# Altium project mb1191.PrjPCB (part 2 of 3)

## Sheet Arduino_ Connectors.SchDoc: Arduino UNO connectors
size A4; Date: 25-FEB-2015; Author: A.B; CompanyName: STMicroelectronics; Address1: 12, Rue Jules HOROWITZ; Address2: 38019 Grenoble; Address3: FRANCE; DocumentNumber: MB1191; Revision: B-02; SheetNumber: 8; SheetTotal: 14; Project: STM32F746G-DISCO
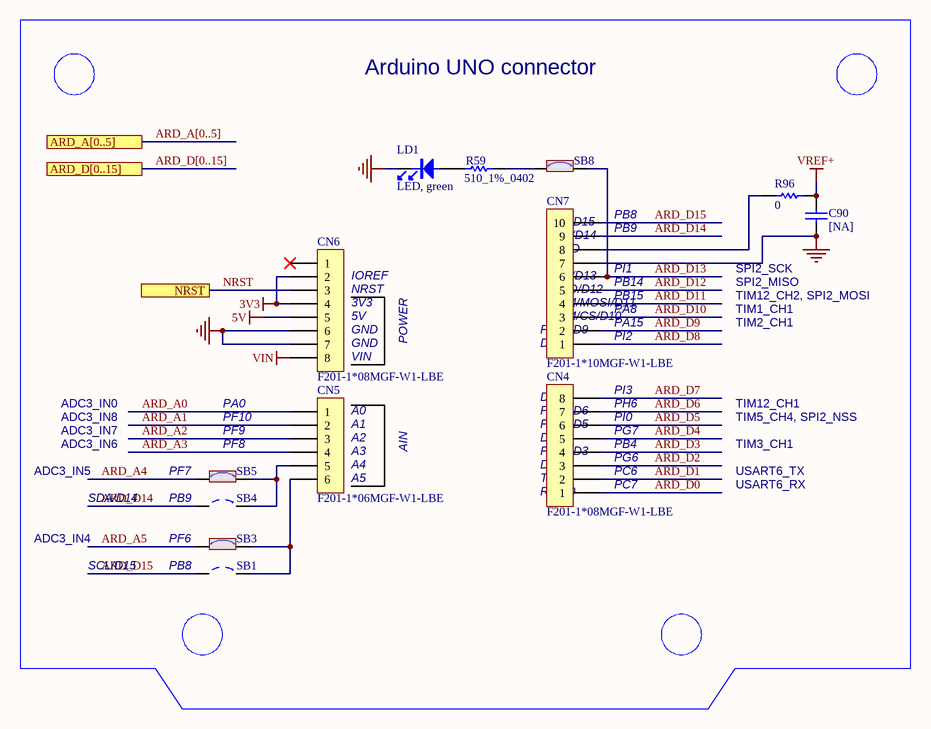
[diagram p8: Arduino_ Connectors.SchDoc]

### Parts
C90  [NA]  [0402C]
CN4  F201-1*08MGF-W1-LBE  [F201-1*08MGF-W1-BA]
CN5  F201-1*06MGF-W1-LBE  [F201-1*06MGF-W1-BA]
CN6  F201-1*08MGF-W1-LBE  [F201-1*08MGF-W1-BA]
CN7  F201-1*10MGF-W1-LBE  [F201-1*10MGF-W1-BA]
LD1  LED, green  [0603D]
R59  510_1%_0402  [0402R]
R96  0  [0402R]
SB1  Solder Bridge OFF  [JP2_SMD]  (value not drawn)
SB3  Solder Bridge ON  [JP2_SMD]  (value not drawn)
SB4  Solder Bridge OFF  [JP2_SMD]  (value not drawn)
SB5  Solder Bridge ON  [JP2_SMD]  (value not drawn)
SB8  Solder Bridge ON  [JP2_SMD]  (value not drawn)

### Ports
ARD_A[0..5], ARD_D[0..15], NRST

### Nets
3V3: CN6.2 CN6.4
5V: CN6.5
GND: C90.1 CN6.6 CN6.7 CN7.7 LD1.2
VIN: CN6.8
VREF+: C90.2 R96.2
ARD_A0: CN5.1
ARD_A1: CN5.2
ARD_A2: CN5.3
ARD_A3: CN5.4
ARD_A4: SB5.1
ARD_A5: SB3.1
ARD_D0: CN4.1
ARD_D1: CN4.2
ARD_D2: CN4.3
ARD_D3: CN4.4
ARD_D4: CN4.5
ARD_D5: CN4.6
ARD_D6: CN4.7
ARD_D7: CN4.8
ARD_D8: CN7.1
ARD_D9: CN7.2
ARD_D10: CN7.3
ARD_D11: CN7.4
ARD_D12: CN7.5
ARD_D13: CN7.6 SB8.2
ARD_D14: CN7.9 SB4.1
ARD_D15: CN7.10 SB1.1
NRST: CN6.3 ; port NRST  [project net DCMI_NRST]
NetCN5_5: CN5.5 SB4.2 SB5.2
NetCN5_6: CN5.6 SB1.2 SB3.2
NetCN7_8: CN7.8 R96.1
NetLD1_1: LD1.1 R59.1
NetR59_2: R59.2 SB8.1

Not connected (* = marked no-connect by the designer): CN6 1*

### Buses and harness runs
bus ARD_A[0..5] = port ARD_A[0..5]
bus ARD_D[0..15] = port ARD_D[0..15]

### Notes on the sheet
- Arduino UNO connector
- PB8
- (near CN6) IOREF
- (near CN6) NRST
- (near CN7) SDA/D14
- (near CN7) SCL/D15
- (near CN7) SCK/D13
- (near CN7) MISO/D12
- (near CN7) AVDD
- (near CN7) GND
- (near CN7) PB14
- (near CN7) PI1
- (near CN7) PB9
- SPI2_MISO
- SPI2_SCK
- (near CN6) 3V3
- (near CN6) 5V
- (near CN6) GND
- POWER
- (near CN7) D8
- (near CN7) PWM/D9
- (near CN7) PWM/CS/D10
- (near CN7) PWM/MOSI/D11
- (near CN7) PI2
- (near CN7) PA15
- (near CN7) PA8
- (near CN7) PB15
- TIM2_CH1
- TIM1_CH1
- TIM12_CH2, SPI2_MOSI
- ADC3_IN8
- ADC3_IN0
- PA0
- PF10
- (near CN5) A0
- (near CN5) A1
- (near CN6) VIN
- (near CN4) PWM/D5
- (near CN4) PWM/D6
- (near CN4) D7
- (near CN4) PI0
- (near CN4) PH6
- PI3
- TIM5_CH4, SPI2_NSS
- TIM12_CH1
- ADC3_IN5
- ADC3_IN6
- ADC3_IN7
- PF7
- (near SB5) PF9
- (near SB5) PF8
- (near CN5) A2
- (near CN5) A3
- (near CN5) A4
- (near CN5) A5
- AIN
- (near CN4) TX/D1
- (near CN4) D2
- (near CN4) D4
- (near CN4) PWM/D3
- (near CN4) PC6
- (near CN4) PG6
- (near CN4) PB4
- (near CN4) PG7
- (near CN4) PC7
- USART6_RX
- USART6_TX
- TIM3_CH1
- ADC3_IN4
- SDA/D14
- PF6
- PB9
- (near CN4) RX/D0
- SCL/D15
- Title:
- Project:
- Size:
- Revision:
- Variant:
- -
- Date:
- Reference:
- Sheet:
- of

### Library data of the parts
C90 = Cap_NA_0402: Capacitor,NA,0402; Fitted: NO; Revision: July-2002: Re-released for DXP Platform.; Value: [NA]; ECCN_US/EU: n/a
CN4 CN6 = F201-1*08MGF-W1-BA: Header, 8-Pins, Single row, female SMD; Manuf_1: TOWNES; Manuf_Part_2: SSW-108-22-L-S-VS; Manuf_2: SAMTEC; Manuf_Part_1: F201-1*08MGF-W1-LBE; Distrib: Sub Co; ECCN_US/EU: n/a
CN5 = F201-1*06MGF-W1-BA: Header, 6-Pins, Single row, female SMD; Manuf_1: TOWNES; Manuf_Part_2: SSW-106-22-L-S-VS; Manuf_2: SAMTEC; Manuf_Part_1: F201-1*06MGF-W1-LBE; Distrib: Sub Co; ECCN_US/EU: n/a
CN7 = F201-1*10MGF-W1-BA: Header, 10-Pins, Single row, female SMD; Manuf_1: TOWNES; Manuf_Part_2: SSW-110-22-L-S-VS; Manuf_2: SAMTEC; Manuf_Part_1: F201-1*10MGF-W1-LBE; Distrib: Sub Co; ECCN_US/EU: n/a
LD1 = LED_green: as LD5 on sheet USB_OTG_FS; Order: 19-213SYGC/S530-E2/TR8
R59 = Res_510_1%_0402: Resistor,510,0402,1%,YAGEO; Manuf_Part_1: RC0402FR-07510L; Value: 510; Manuf_1: YAGEO; Order: RC0402FR-07510L; ECCN_US/EU: n/a; Distrib: DIGIKEY
R96 = Res_0_5%_0402: as R76 on sheet AUDIO; Value: 0; ECCN_US/EU: n/a; Manuf_1: YAGEO; Distrib: FARNELL
SB1 SB4 = SB_OFF: Solder: NO; Revision: July-2002: Re-released for DXP Platform.; ECCN_US/EU: n/a
SB3 SB5 SB8 = SB_ON: Solder: YES; Revision: July-2002: Re-released for DXP Platform.; ECCN_US/EU: n/a

## Sheet SDRAM.SchDoc: SDRAM (MICRON)
size A4; Date: 25-FEB-2015; Author: A.B; CompanyName: STMicroelectronics; Address1: 12, Rue Jules HOROWITZ; Address2: 38019 Grenoble; Address3: FRANCE; DocumentNumber: MB1191; Revision: B-02; SheetNumber: 10; SheetTotal: 14; Project: STM32F746G-DISCO
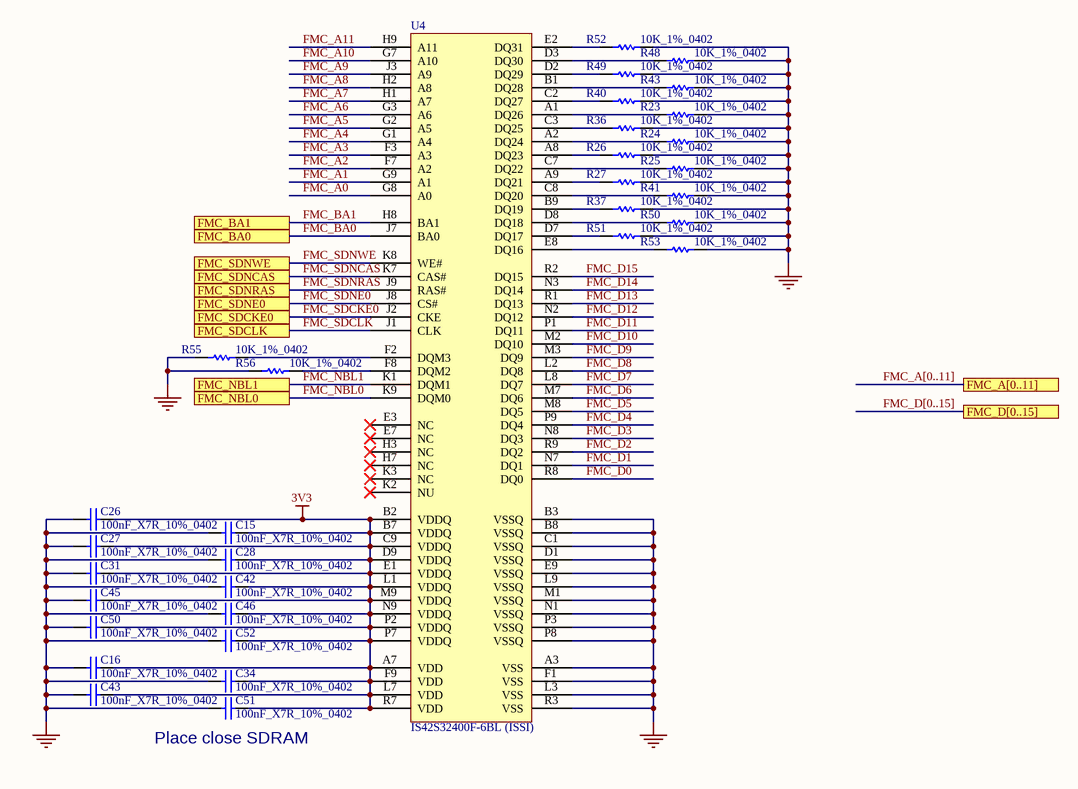
[diagram p9: SDRAM.SchDoc]

### Parts
C15  100nF_X7R_10%_0402  [0402C]
C16  100nF_X7R_10%_0402  [0402C]
C26  100nF_X7R_10%_0402  [0402C]
C27  100nF_X7R_10%_0402  [0402C]
C28  100nF_X7R_10%_0402  [0402C]
C31  100nF_X7R_10%_0402  [0402C]
C34  100nF_X7R_10%_0402  [0402C]
C42  100nF_X7R_10%_0402  [0402C]
C43  100nF_X7R_10%_0402  [0402C]
C45  100nF_X7R_10%_0402  [0402C]
C46  100nF_X7R_10%_0402  [0402C]
C50  100nF_X7R_10%_0402  [0402C]
C51  100nF_X7R_10%_0402  [0402C]
C52  100nF_X7R_10%_0402  [0402C]
R23  10K_1%_0402  [0402R]
R24  10K_1%_0402  [0402R]
R25  10K_1%_0402  [0402R]
R26  10K_1%_0402  [0402R]
R27  10K_1%_0402  [0402R]
R36  10K_1%_0402  [0402R]
R37  10K_1%_0402  [0402R]
R40  10K_1%_0402  [0402R]
R41  10K_1%_0402  [0402R]
R43  10K_1%_0402  [0402R]
R48  10K_1%_0402  [0402R]
R49  10K_1%_0402  [0402R]
R50  10K_1%_0402  [0402R]
R51  10K_1%_0402  [0402R]
R52  10K_1%_0402  [0402R]
R53  10K_1%_0402  [0402R]
R55  10K_1%_0402  [0402R]
R56  10K_1%_0402  [0402R]
U4  IS42S32400F-6BL (ISSI)  [FBGA90_0R8_8X13]

### Ports
FMC_A[0..11], FMC_BA0, FMC_BA1, FMC_D[0..15], FMC_NBL0, FMC_NBL1, FMC_SDCKE0, FMC_SDCLK, FMC_SDNCAS, FMC_SDNE0, FMC_SDNRAS, FMC_SDNWE

### Nets
3V3: C15.2 C16.2 C26.2 C27.2 C28.2 C31.2 C34.2 C42.2 C43.2 C45.2 C46.2 C50.2 C51.2 C52.2 U4.A7(VDD) U4.B2(VDDQ) U4.B7(VDDQ) U4.C9(VDDQ) U4.D9(VDDQ) U4.E1(VDDQ) U4.F9(VDD) U4.L1(VDDQ) U4.L7(VDD) U4.M9(VDDQ) U4.N9(VDDQ) U4.P2(VDDQ) U4.P7(VDDQ) U4.R7(VDD)
GND: C15.1 C16.1 C26.1 C27.1 C28.1 C31.1 C34.1 C42.1 C43.1 C45.1 C46.1 C50.1 C51.1 C52.1 R23.2 R24.2 R25.2 R26.2 R27.2 R36.2 R37.2 R40.2 R41.2 R43.2 R48.2 R49.2 R50.2 R51.2 R52.2 R53.2 R55.1 R56.1 U4.A3(VSS) U4.B3(VSSQ) U4.B8(VSSQ) U4.C1(VSSQ) U4.D1(VSSQ) U4.E9(VSSQ) U4.F1(VSS) U4.L3(VSS) U4.L9(VSSQ) U4.M1(VSSQ) U4.N1(VSSQ) U4.P3(VSSQ) U4.P8(VSSQ) U4.R3(VSS)
FMC_A0: U4.G8(A0)
FMC_A1: U4.G9(A1)
FMC_A2: U4.F7(A2)
FMC_A3: U4.F3(A3)
FMC_A4: U4.G1(A4)
FMC_A5: U4.G2(A5)
FMC_A6: U4.G3(A6)
FMC_A7: U4.H1(A7)
FMC_A8: U4.H2(A8)
FMC_A9: U4.J3(A9)
FMC_A10: U4.G7(A10)
FMC_A11: U4.H9(A11)
FMC_BA0: U4.J7(BA0) ; port FMC_BA0
FMC_BA1: U4.H8(BA1) ; port FMC_BA1
FMC_D0: U4.R8(DQ0)
FMC_D1: U4.N7(DQ1)
FMC_D2: U4.R9(DQ2)
FMC_D3: U4.N8(DQ3)
FMC_D4: U4.P9(DQ4)
FMC_D5: U4.M8(DQ5)
FMC_D6: U4.M7(DQ6)
FMC_D7: U4.L8(DQ7)
FMC_D8: U4.L2(DQ8)
FMC_D9: U4.M3(DQ9)
FMC_D10: U4.M2(DQ10)
FMC_D11: U4.P1(DQ11)
FMC_D12: U4.N2(DQ12)
FMC_D13: U4.R1(DQ13)
FMC_D14: U4.N3(DQ14)
FMC_D15: U4.R2(DQ15)
FMC_NBL0: U4.K9(DQM0) ; port FMC_NBL0
FMC_NBL1: U4.K1(DQM1) ; port FMC_NBL1
FMC_SDCKE0: U4.J2(CKE) ; port FMC_SDCKE0
FMC_SDCLK: U4.J1(CLK) ; port FMC_SDCLK
FMC_SDNCAS: U4.K7(CAS#) ; port FMC_SDNCAS
FMC_SDNE0: U4.J8(CS#) ; port FMC_SDNE0
FMC_SDNRAS: U4.J9(RAS#) ; port FMC_SDNRAS
FMC_SDNWE: U4.K8(WE#) ; port FMC_SDNWE
NetR23_1: R23.1 U4.A1(DQ26)
NetR24_1: R24.1 U4.A2(DQ24)
NetR25_1: R25.1 U4.C7(DQ22)
NetR26_1: R26.1 U4.A8(DQ23)
NetR27_1: R27.1 U4.A9(DQ21)
NetR36_1: R36.1 U4.C3(DQ25)
NetR37_1: R37.1 U4.B9(DQ19)
NetR40_1: R40.1 U4.C2(DQ27)
NetR41_1: R41.1 U4.C8(DQ20)
NetR43_1: R43.1 U4.B1(DQ28)
NetR48_1: R48.1 U4.D3(DQ30)
NetR49_1: R49.1 U4.D2(DQ29)
NetR50_1: R50.1 U4.D8(DQ18)
NetR51_1: R51.1 U4.D7(DQ17)
NetR52_1: R52.1 U4.E2(DQ31)
NetR53_1: R53.1 U4.E8(DQ16)
NetR55_2: R55.2 U4.F2(DQM3)
NetR56_2: R56.2 U4.F8(DQM2)

Not connected (* = marked no-connect by the designer): U4 E3(NC)* E7(NC)* H3(NC)* H7(NC)* K2(NU)* K3(NC)*

### Buses and harness runs
bus FMC_A[0..11] = port FMC_A[0..11]
bus FMC_D[0..15] = port FMC_D[0..15]

### Notes on the sheet
- (near C51) Place close SDRAM
- Title:
- Project:
- Size:
- Revision:
- Variant:
- A4
- -
- Date:
- Reference:
- Sheet:
- of

### Library data of the parts
C15 C16 C26-C28 C31 C34 C42 C43 C45 C46 C50-C52 = Cap_100nF_X7R_10%_0402: as C61 on sheet ST_LINK_V2-1; Revision: July-2002: Re-released for DXP Platform.; Value: 100nF; Order: CC0402KRX7R7BB104; Manuf_1: YAGEO; ECCN_US/EU: n/a
R23-R27 R36 R37 R40 R41 R43 R48-R53 R55 R56 = Res_10K_1%_0402: as R60 on sheet ST_LINK_V2-1; Value: 10K; Manuf_1: YAGEO; Order: RC0402FR-0710KL; ECCN_US/EU: n/a
U4 = MT48LC4M32B2B5-6A: SDRAM 128MBIT (4M x 32) 166MHZ 90-VFBGA (8x13); Order: IS42S32400F-6BL-ND; ECCN_US/EU: EAR99/NEC; Provided: SUBCO; Manuf_Part_1: IS42S32400F-6BL; Manuf_1: ISSI

## Sheet USB_OTG_HS.SchDoc: USB OTG HS PHY with Micro A-B connector
size A4; Date: 25-FEB-2015; Author: A.B; CompanyName: STMicroelectronics; Address1: 12, Rue Jules HOROWITZ; Address2: 38019 Grenoble; Address3: FRANCE; DocumentNumber: MB1191; Revision: B-02; SheetNumber: 11; SheetTotal: 14; Project: STM32F746G-DISCO
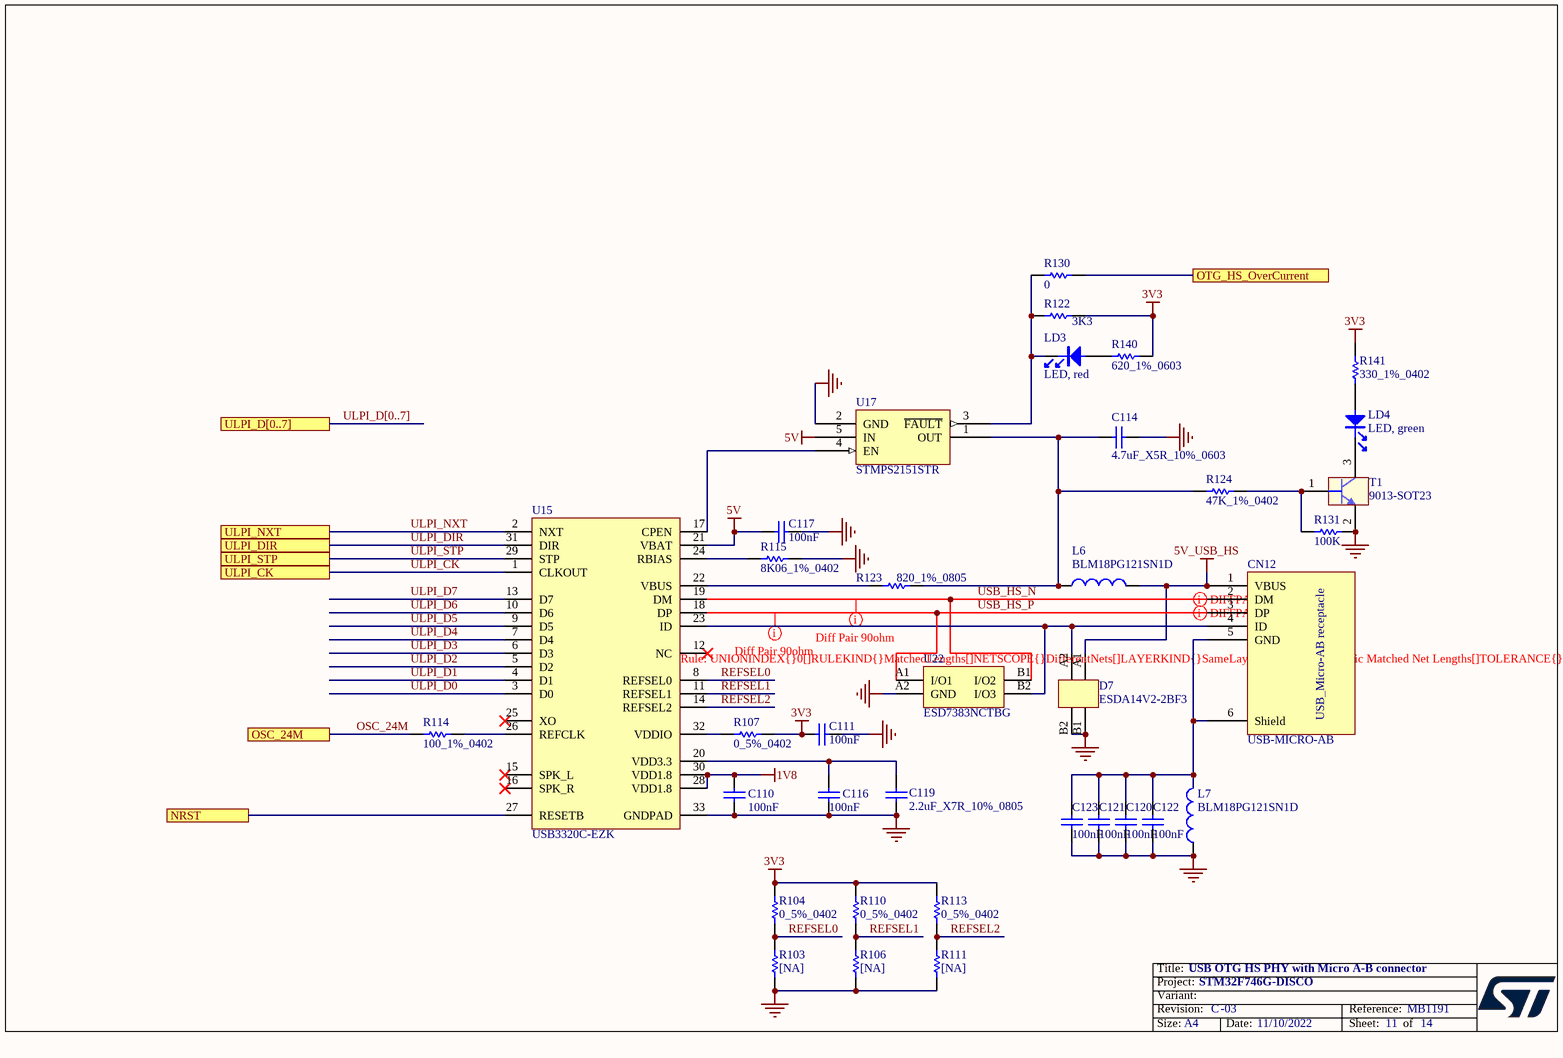
[diagram p10: USB_OTG_HS.SchDoc]

### Parts
C110  100nF  [0402C]
C111  100nF  [0402C]
C114  4.7uF_X5R_10%_0603  [0603C]
C116  100nF  [0402C]
C117  100nF  [0402C]
C119  2.2uF_X7R_10%_0805  [0805C]
C120  100nF  [0402C]
C121  100nF  [0402C]
C122  100nF  [0402C]
C123  100nF  [0402C]
CN12  USB-MICRO-AB  [USB-MICRO-AB]
D7  ESDA14V2-2BF3  [BGA4_1X1]
L6  BLM18PG121SN1D  [0603L]
L7  BLM18PG121SN1D  [0603L]
LD3  LED, red  [0603D]
LD4  LED, green  [0603D]
R103  [NA]  [0402R]
R104  0_5%_0402  [0402R]
R106  [NA]  [0402R]
R107  0_5%_0402  [0402R]
R110  0_5%_0402  [0402R]
R111  [NA]  [0402R]
R113  0_5%_0402  [0402R]
R114  100_1%_0402  [0402R]
R115  8K06_1%_0402  [0402R]
R122  3K3  [0402R]
R123  820_1%_0805  [0805R]
R124  47K_1%_0402  [0402R]
R130  0  [0402R]
R131  100K  [0402R]
R140  620_1%_0603  [0603R]
R141  330_1%_0402  [0402R]
T1  9013-SOT23  [SOT23]
U15  USB3320C-EZK  [QFN32_0R5_5X5]
U17  STMPS2151STR  [SOT23-5L]
U22  ESD7383NCTBG  [ESD_WLCSP4_CASE-567CB_0P80X0P80_P040]

### Ports
NRST, OSC_24M, OTG_HS_OverCurrent, ULPI_CK, ULPI_D[0..7], ULPI_DIR, ULPI_NXT, ULPI_STP

### Nets
1V8: C110.2 U15.28(VDD1.8) U15.30(VDD1.8)
3V3: C111.1 R104.2 R107.2 R110.2 R113.2 R122.1 R140.2 R141.2
5V: C117.1 U15.21(VBAT) U17.5(IN)
5V_USB_HS: CN12.1(VBUS) D7.A1 L6.2
GND: C110.1 C111.2 C114.2 C116.1 C117.2 C119.1 C120.1 C121.1 C122.1 C123.1 D7.B1 D7.B2 L7.1 R103.1 R106.1 R111.1 R115.2 R131.2 T1.2(E) U15.33(GNDPAD) U17.2(GND) U22.A2(GND)
DCMI_NRST: U15.27(RESETB) ; port NRST
OSC_24M: R114.1 ; port OSC_24M
OTG_HS_OverCurrent: R130.2 ; port OTG_HS_OverCurrent
REFSEL0: R103.2 R104.1 U15.8(REFSEL0)
REFSEL1: R106.2 R110.1 U15.11(REFSEL1)
REFSEL2: R111.2 R113.1 U15.14(REFSEL2)
ULPI_CK: U15.1(CLKOUT) ; port ULPI_CK  [project net PA5]
ULPI_D0: U15.3(D0)  [project net PA3]
ULPI_D1: U15.4(D1)  [project net PB0]
ULPI_D2: U15.5(D2)  [project net PB1]
ULPI_D3: U15.6(D3)  [project net PB10]
ULPI_D4: U15.7(D4)  [project net PB11]
ULPI_D5: U15.9(D5)  [project net PB12]
ULPI_D6: U15.10(D6)  [project net PB13]
ULPI_D7: U15.13(D7)  [project net PB5]
ULPI_DIR: U15.31(DIR) ; port ULPI_DIR  [project net PC2]
ULPI_NXT: U15.2(NXT) ; port ULPI_NXT  [project net PH4]
ULPI_STP: U15.29(STP) ; port ULPI_STP  [project net PC0]
USB_HS_N: CN12.2(DM) U15.19(DM) U22.B1(I/O2)
USB_HS_P: CN12.3(DP) U15.18(DP) U22.A1(I/O1)
NetC114_1: C114.1 L6.1 R123.2 R124.1 U17.1(OUT)
NetC116_2: C116.2 C119.2 U15.20(VDD3.3)
NetC120_2: C120.2 C121.2 C122.2 C123.2 CN12.5(GND) CN12.6(Shield) L7.2
NetCN12_4: CN12.4(ID) D7.A2 U15.23(ID) U22.B2(I/O3)
NetLD3_1: LD3.1 R140.1
NetLD3_2: LD3.2 R122.2 R130.1 U17.3(~{FAULT})
NetLD4_1: LD4.1 R141.1
NetLD4_2: LD4.2 T1.3(C)
NetR107_1: R107.1 U15.32(VDDIO)
NetR114_2: R114.2 U15.26(REFCLK)
NetR115_1: R115.1 U15.24(RBIAS)
NetR123_1: R123.1 U15.22(VBUS)
NetR124_2: R124.2 R131.1 T1.1(B)
NetU15_17: U15.17(CPEN) U17.4(EN)

Not connected (* = marked no-connect by the designer): U15 12(NC)* 15(SPK_L)* 16(SPK_R)* 25(XO)*

### Buses and harness runs
bus ULPI_D[0..7] = port ULPI_D[0..7]

### Layout directives
differential pair: USB_HS_N, USB_HS_P
rule Matched Net Lengths [Tolerance = 150mil]: USB_HS_N, USB_HS_P

### Notes on the sheet
- Title:
- Project:
- Size:
- Revision:
- Variant:
- A4
- -
- Date:
- Reference:
- Sheet:
- of
- (in symbol USB-MICRO-AB) USB_Micro-AB receptacle

### Library data of the parts
C110 C111 C116 C117 C120-C123 = Cap_100nF_X7R_10%_0402: Capacitor,100nF,16V,X7R,10%,0402,YAGEO; Manuf_Part_1: CC0402KRX7R7BB104; Revision: July-2002: Re-released for DXP Platform.; Value: 100nF; Order: CC0402KRX7R7BB104; Manuf_1: YAGEO
C114 = Cap_4.7uF_X5R_10%_0603: Capacitor,4.7uF,16V, X5R,10%,0603,YAGEO; Manuf_Part_1: CC0603KRX5R7BB475; Order: CC0603KRX5R7BB105; Revision: July-2002: Re-released for DXP Platform.; Value: 4.7uF; Manuf_1: YAGEO; ECCN_US/EU: n/a
C119 = Cap_2.2uF_X7R_10%_0805: Capacitor,2.2uF,16V, X7R,10%,0805,YAGEO; Manuf_Part_1: CC0805KKX7R7BB225; Revision: July-2002: Re-released for DXP Platform.; Value: 2.2uF; Order: CC0805KKX7R7BB225; Manuf_1: YAGEO; ECCN_US/EU: n/a
CN12 = USB-MICRO-AB: USB-MICRO-AB, 47590-0001, SMT, MOLEX; Ref St: xxxxxxx; Manuf_1: MOLEX; Manuf_Part_1: 47590-0001; ECCN_US/EU: n/a; Distrib: *
D7 = ESDA14V2-2BF3: Quad bidirectional Transil array for ESD protection; Manuf_1: STM; ECCN_US/EU: EAR99/NEC; Provided: ST; Ref St: 9179040; Distrib: ST; Manuf_Part_1: ESDA14V2-2BF3
L6 L7 = BEAD_120R_2A_0603: Bead,120R,2A,0603,BLM18PG121SN1D,MURATA; Manuf_Part_3: FCM1608KF-601T03; Manuf_2: TDK; Manuf_Part_2: MPZ1608S300A; Manuf_3: Tai-tech; Value: 100uH; Description_3: Bead,600R,350mA,0603,FCM1608KF-601T03,Tai-tech; Description_2: Bead,30R,5A,0603,MPZ1608S300A,TDK; Revision: July-2002: Re-released for DXP Platform.; ECCN_US/EU: n/a; Manuf_Part_1: BLM18PG121SN1D; Manuf_1: MURATA
LD3 = LED_red: LED, red, 0603; Manuf_1: everlight; Manuf_Part_1: 19-217/R6C-AL1M2VY/3T; ECCN_US/EU: EAR99/NEC; Order: 19-217/R6C-AL1M2VY/3T
LD4 = LED_green: LED, green, 0603; Manuf_1: everlight; Manuf_Part_1: 19-213SYGC/S530-E2/TR8; ECCN_US/EU: EAR99/NEC; Order: 19-213SYGC/S530-E2/TR8
R103 R106 R111 = Res_NA_0402: Resistor,[NA],0402; Fitted: NO; Value: [NA]; ECCN_US/EU: n/a
R104 R107 R110 R113 = Res_0_5%_0402: Resistor,0,0402,5%,YAGEO; Manuf_Part_1: RC0402JR-070RL; Value: 0; Order: 2363467; ECCN_US/EU: n/a; Manuf_1: YAGEO; Distrib: FARNELL
R114 = Res_100_1%_0402: Resistor,100,0402,1%,YAGEO; Manuf_Part_1: RC0402FR-07100RL; Value: 100; Order: 9239111; Manuf_1: YAGEO; ECCN_US/EU: n/a; Distrib: FARNELL
R115 = Res_8K06_1%_0402: Resistor,8K06,0402,1%,YAGEO; Manuf_Part_1: RC0402FR-078K06L; Value: 8K06; Manuf_1: YAGEO; Order: RC0402FR-078K06L; ECCN_US/EU: n/a; Distrib: DIGIKEY
R122 = Res_3K3_1%_0402: Resistor,3K3,0402,1%,YAGEO; Manuf_Part_1: RC0402FR-073K3L; Value: 3K3; Manuf_1: YAGEO; Order: *; ECCN_US/EU: n/a; Distrib: FARNELL
R123 = Res_820_1%_0805: Resistor,820,0805,1%,YAGEO; Manuf_Part_1: RC0805FR-07820RL; Value: 820; Manuf_1: YAGEO; Order: RC0805FR-07820RL; ECCN_US/EU: n/a
R124 = Res_47K_1%_0402: Resistor,47K,0402,1%,YAGEO; Manuf_Part_1: RC0402FR-0747KL; Order: 9239430; Value: 47K; Manuf_1: YAGEO; ECCN_US/EU: n/a; Distrib: FARNELL
R130 = Res_0_5%_0402: Resistor,0,0402,5%,YAGEO; Manuf_Part_1: RC0402JR-070RL; Order: 2363467; Value: 0; ECCN_US/EU: n/a; Manuf_1: YAGEO; Distrib: FARNELL
R131 = Res_100K_1%_0402: Resistor,100K,0402,1%,YAGEO; Manuf_Part_1: RT0402FRE07100KL; Value: 100K; Manuf_1: YAGEO; Order: RT0402FRE07100KL; ECCN_US/EU: n/a
R140 = Res_620_1%_0603: Resistor,620,0603,1%,VISHAY; Manuf_Part_1: CRCW0603620RFKEA; Manuf_1: VISHAY DRALORIC; Value: 620; Order: 2122341; ECCN_US/EU: n/a; Distrib: FARNELL
R141 = Res_330_1%_0402: Resistor,330,0402,1%,YAGEO; Manuf_Part_1: RC0402FR-07330RL; Value: 330; ECCN_US/EU: n/a; Manuf_1: YAGEO; Distrib: DIGIKEY; Order: RC0402FR-07330RL
T1 = 9013-SOT23: NPN Bipolar Transistor; Manuf_1: NXP; Manuf_Part_1: BSR14; Order: 1081310; ECCN_US/EU: EAR99/NEC; Revision: July-2002: Re-released for DXP Platform.; Distrib: FARNELL
U15 = USB3320C-EZK: USB3320C,  Hi-Speed USB Host, Device or OTG PHY with ULPI Low Pin Interface; Manuf_1: MICROCHIP; Manuf_Part_1: USB3320C-EZK-TR; Distrib: MICROCHIP; Order: USB3320C-EZK-TR; ECCN_US/EU: *
U17 = STMPS2151STR: Enhanced single channel power switches; Manuf_1: STM; Provided: ST; ECCN_US/EU: EAR99/NEC; Ref St: xxxxxx; Order: STMPS2151STR; Manuf_Part_1: STMPS2151STR; Distrib: ST
U22 = ESD7383NCTBG: 3-line low capacitance protection for high speed USB; Manuf_1: ON SEMICONDUCTOR; ECCN_US/EU: EAR99/NEC; provided: SUBCO; Manuf_Part_1: ESD7383NCTBG; value: ESD7383NCTBG

## Sheet STM32F7.SchDoc: STM32 MCU Connexion
size A3; Date: 25-FEB-2015; Author: A.B; CompanyName: STMicroelectronics; Address1: 12, Rue Jules HOROWITZ; Address2: 38019 Grenoble; Address3: FRANCE; DocumentNumber: MB1191; Revision: B-02; SheetNumber: 3; SheetTotal: 14; Project: STM32F746G-DISCO
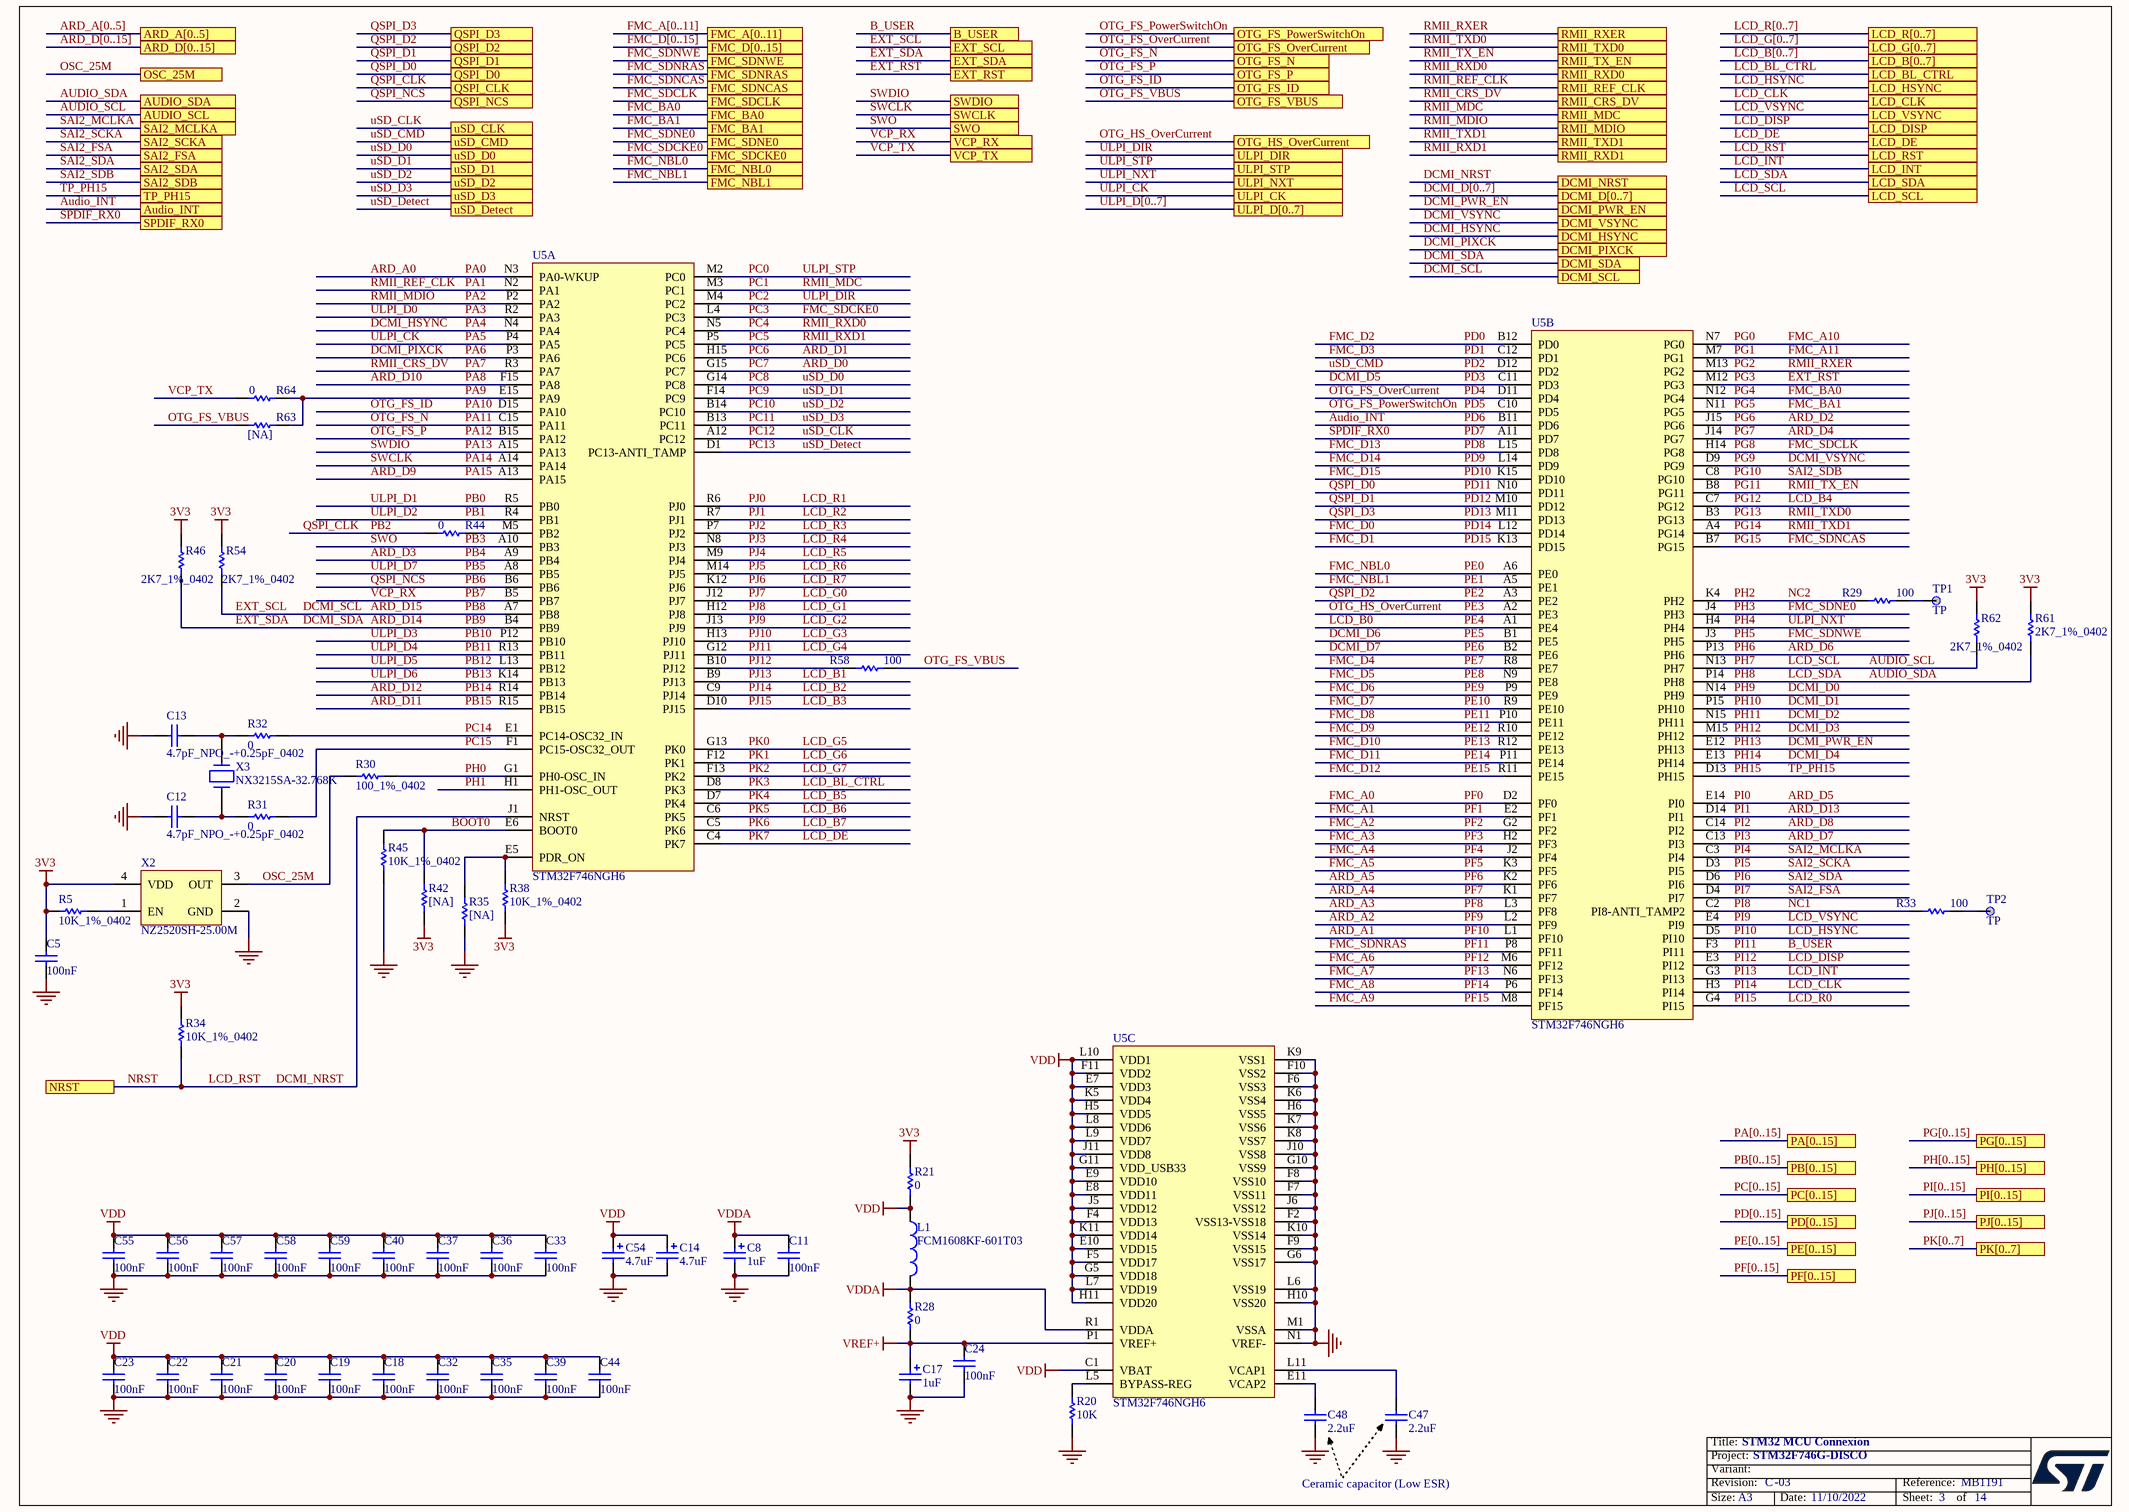
[diagram p11: STM32F7.SchDoc]

### Parts
C5  100nF  [0402C]
C8  1uF  [TAN-A]
C11  100nF  [0402C]
C12  4.7pF_NPO_-+0.25pF_0402  [0402C]
C13  4.7pF_NPO_-+0.25pF_0402  [0402C]
C14  4.7uF  [TAN-A]
C17  1uF  [TAN-A]
C18  100nF  [0402C]
C19  100nF  [0402C]
C20  100nF  [0402C]
C21  100nF  [0402C]
C22  100nF  [0402C]
C23  100nF  [0402C]
C24  100nF  [0402C]
C32  100nF  [0402C]
C33  100nF  [0402C]
C35  100nF  [0402C]
C36  100nF  [0402C]
C37  100nF  [0402C]
C39  100nF  [0402C]
C40  100nF  [0402C]
C44  100nF  [0402C]
C47  2.2uF  [1206C]
C48  2.2uF  [1206C]
C54  4.7uF  [TAN-A]
C55  100nF  [0402C]
C56  100nF  [0402C]
C57  100nF  [0402C]
C58  100nF  [0402C]
C59  100nF  [0402C]
L1  FCM1608KF-601T03  [0603L]
R5  10K_1%_0402  [0402R]
R20  10K  [0402R]
R21  0  [0603R-GS]
R28  0  [0603R-GS]
R29  100  [0402R]
R30  100_1%_0402  [0402R]
R31  0  [0402R]
R32  0  [0402R]
R33  100  [0402R]
R34  10K_1%_0402  [0402R]
R35  [NA]  [0402R]
R38  10K_1%_0402  [0402R]
R42  [NA]  [0402R]
R44  0  [0402R]
R45  10K_1%_0402  [0402R]
R46  2K7_1%_0402  [0402R]
R54  2K7_1%_0402  [0402R]
R58  100  [0402R]
R61  2K7_1%_0402  [0402R]
R62  2K7_1%_0402  [0402R]
R63  [NA]  [0402R]
R64  0  [0402R]
TP1  TP  [SMDTEST-1MM]
TP2  TP  [SMDTEST-1MM]
U5  STM32F746NGH6  [BGA216_0R8_13X13_SKT]  (parts A,B,C of 3)
X2  NZ2520SH-25.00M  [NZ2520SH_4P]
X3  NX3215SA-32.768K  [XTAL_2SM_3R2X1R5]

### Ports
ARD_A[0..5], ARD_D[0..15], Audio_INT, AUDIO_SCL, AUDIO_SDA, B_USER, DCMI_D[0..7], DCMI_HSYNC, DCMI_NRST, DCMI_PIXCK, DCMI_PWR_EN, DCMI_SCL, DCMI_SDA, DCMI_VSYNC, EXT_RST, EXT_SCL, EXT_SDA, FMC_A[0..11], FMC_BA0, FMC_BA1, FMC_D[0..15], FMC_NBL0, FMC_NBL1, FMC_SDCKE0, FMC_SDCLK, FMC_SDNCAS, FMC_SDNE0, FMC_SDNRAS, FMC_SDNWE, LCD_B[0..7], LCD_BL_CTRL, LCD_CLK, LCD_DE, LCD_DISP, LCD_G[0..7], LCD_HSYNC, LCD_INT, LCD_R[0..7], LCD_RST, LCD_SCL, LCD_SDA, LCD_VSYNC, NRST, OSC_25M, OTG_FS_ID, OTG_FS_N, OTG_FS_OverCurrent, OTG_FS_P, OTG_FS_PowerSwitchOn, OTG_FS_VBUS, OTG_HS_OverCurrent, PA[0..15], PB[0..15], PC[0..15], PD[0..15], PE[0..15], PF[0..15], PG[0..15], PH[0..15], PI[0..15], PJ[0..15], PK[0..7], QSPI_CLK, QSPI_D0, QSPI_D1, QSPI_D2, QSPI_D3, QSPI_NCS, RMII_CRS_DV, RMII_MDC, RMII_MDIO, RMII_REF_CLK, RMII_RXD0, RMII_RXD1, RMII_RXER, RMII_TX_EN, RMII_TXD0, RMII_TXD1, SAI2_FSA, SAI2_MCLKA, SAI2_SCKA, SAI2_SDA, SAI2_SDB, SPDIF_RX0, SWCLK, SWDIO, SWO, TP_PH15, ULPI_CK, ULPI_D[0..7], ULPI_DIR, ULPI_NXT, ULPI_STP, uSD_CLK, uSD_CMD, uSD_D0, uSD_D1, uSD_D2, uSD_D3, uSD_Detect, VCP_RX, VCP_TX

### Nets
3V3: C5.2 R5.1 R21.2 R34.2 R38.1 R42.1 R46.2 R54.2 R61.2 R62.2 X2.4(VDD)
GND: C5.1 C8.2 C11.1 C12.1 C13.1 C14.2 C17.2 C18.1 C19.1 C20.1 C21.1 C22.1 C23.1 C24.1 C32.1 C33.1 C35.1 C36.1 C37.1 C39.1 C40.1 C44.1 C47.1 C48.1 C54.2 C55.1 C56.1 C57.1 C58.1 C59.1 R20.1 R35.1 R45.1 U5.F2(VSS13-VSS18) U5.F6(VSS3) U5.F7(VSS11) U5.F8(VSS10) U5.F9(VSS15) U5.F10(VSS2) U5.G6(VSS17) U5.G10(VSS9) U5.H6(VSS5) U5.H10(VSS20) U5.J6(VSS12) U5.J10(VSS8) U5.K6(VSS4) U5.K7(VSS6) U5.K8(VSS7) U5.K9(VSS1) U5.K10(VSS14) U5.L6(VSS19) U5.M1(VSSA) U5.N1(VREF-) X2.2(GND)
VDD: C14.1 C18.2 C19.2 C20.2 C21.2 C22.2 C23.2 C32.2 C33.2 C35.2 C36.2 C37.2 C39.2 C40.2 C44.2 C54.1 C55.2 C56.2 C57.2 C58.2 C59.2 L1.1 R21.1 U5.C1(VBAT) U5.E7(VDD3) U5.E8(VDD11) U5.E9(VDD10) U5.E10(VDD15) U5.F4(VDD13) U5.F5(VDD17) U5.F11(VDD2) U5.G5(VDD18) U5.G11(VDD_USB33) U5.H5(VDD5) U5.H11(VDD20) U5.J5(VDD12) U5.J11(VDD8) U5.K5(VDD4) U5.K11(VDD14) U5.L7(VDD19) U5.L8(VDD6) U5.L9(VDD7) U5.L10(VDD1)
VDDA: C8.1 C11.2 L1.2 R28.1 U5.R1(VDDA)
VREF+: C17.1 C24.2 R28.2 U5.P1(VREF+)
ARD_A0: U5.N3(PA0-WKUP)  [also labelled PA0]
ARD_A1: U5.L1(PF10)  [also labelled PF10]
ARD_A2: U5.L2(PF9)  [also labelled PF9]
ARD_A3: U5.L3(PF8)  [also labelled PF8]
ARD_A4: U5.K1(PF7)  [also labelled PF7]
ARD_A5: U5.K2(PF6)  [also labelled PF6]
ARD_D0: U5.G15(PC7)  [also labelled PC7]
ARD_D1: U5.H15(PC6)  [also labelled PC6]
ARD_D2: U5.J15(PG6)  [also labelled PG6]
ARD_D3: U5.A9(PB4)  [also labelled PB4]
ARD_D4: U5.J14(PG7)  [also labelled PG7]
ARD_D5: U5.E14(PI0)  [also labelled PI0]
ARD_D6: U5.P13(PH6)  [also labelled PH6]
ARD_D7: U5.C13(PI3)  [also labelled PI3]
ARD_D8: U5.C14(PI2)  [also labelled PI2]
ARD_D9: U5.A13(PA15)  [also labelled PA15]
ARD_D10: U5.F15(PA8)  [also labelled PA8]
ARD_D11: U5.R15(PB15)  [also labelled PB15]
ARD_D12: U5.R14(PB14)  [also labelled PB14]
ARD_D13: U5.D14(PI1)  [also labelled PI1]
ARD_D14: R46.1 U5.B4(PB9) ; port DCMI_SDA, port EXT_SDA  [also labelled DCMI_SDA, EXT_SDA, PB9]
ARD_D15: R54.1 U5.A7(PB8) ; port DCMI_SCL, port EXT_SCL  [also labelled DCMI_SCL, EXT_SCL, PB8]
Audio_INT: U5.B11(PD6) ; port Audio_INT  [also labelled PD6]
AUDIO_SCL: R62.1 U5.N13(PH7) ; port LCD_SCL, port AUDIO_SCL  [also labelled LCD_SCL, PH7]
AUDIO_SDA: R61.1 U5.P14(PH8) ; port LCD_SDA, port AUDIO_SDA  [also labelled LCD_SDA, PH8]
B_USER: U5.F3(PI11) ; port B_USER  [also labelled PI11]
BOOT0: R42.2 R45.2 U5.E6(BOOT0)
DCMI_D0: U5.N14(PH9)  [also labelled PH9]
DCMI_D1: U5.P15(PH10)  [also labelled PH10]
DCMI_D2: U5.N15(PH11)  [also labelled PH11]
DCMI_D3: U5.M15(PH12)  [also labelled PH12]
DCMI_D4: U5.E13(PH14)  [also labelled PH14]
DCMI_D5: U5.C11(PD3)  [also labelled PD3]
DCMI_D6: U5.B1(PE5)  [also labelled PE5]
DCMI_D7: U5.B2(PE6)  [also labelled PE6]
DCMI_HSYNC: U5.N4(PA4) ; port DCMI_HSYNC  [also labelled PA4]
DCMI_NRST: R34.1 U5.J1(NRST) ; port NRST, port LCD_RST, port DCMI_NRST  [also labelled LCD_RST, NRST]
DCMI_PIXCK: U5.P3(PA6) ; port DCMI_PIXCK  [also labelled PA6]
DCMI_PWR_EN: U5.E12(PH13) ; port DCMI_PWR_EN  [also labelled PH13]
DCMI_VSYNC: U5.D9(PG9) ; port DCMI_VSYNC  [also labelled PG9]
EXT_RST: U5.M12(PG3) ; port EXT_RST  [also labelled PG3]
FMC_A0: U5.D2(PF0)  [also labelled PF0]
FMC_A1: U5.E2(PF1)  [also labelled PF1]
FMC_A2: U5.G2(PF2)  [also labelled PF2]
FMC_A3: U5.H2(PF3)  [also labelled PF3]
FMC_A4: U5.J2(PF4)  [also labelled PF4]
FMC_A5: U5.K3(PF5)  [also labelled PF5]
FMC_A6: U5.M6(PF12)  [also labelled PF12]
FMC_A7: U5.N6(PF13)  [also labelled PF13]
FMC_A8: U5.P6(PF14)  [also labelled PF14]
FMC_A9: U5.M8(PF15)  [also labelled PF15]
FMC_A10: U5.N7(PG0)  [also labelled PG0]
FMC_A11: U5.M7(PG1)  [also labelled PG1]
FMC_BA0: U5.N12(PG4) ; port FMC_BA0  [also labelled PG4]
FMC_BA1: U5.N11(PG5) ; port FMC_BA1  [also labelled PG5]
FMC_D0: U5.L12(PD14)  [also labelled PD14]
FMC_D1: U5.K13(PD15)  [also labelled PD15]
FMC_D2: U5.B12(PD0)  [also labelled PD0]
FMC_D3: U5.C12(PD1)  [also labelled PD1]
FMC_D4: U5.R8(PE7)  [also labelled PE7]
FMC_D5: U5.N9(PE8)  [also labelled PE8]
FMC_D6: U5.P9(PE9)  [also labelled PE9]
FMC_D7: U5.R9(PE10)  [also labelled PE10]
FMC_D8: U5.P10(PE11)  [also labelled PE11]
FMC_D9: U5.R10(PE12)  [also labelled PE12]
FMC_D10: U5.R12(PE13)  [also labelled PE13]
FMC_D11: U5.P11(PE14)  [also labelled PE14]
FMC_D12: U5.R11(PE15)  [also labelled PE15]
FMC_D13: U5.L15(PD8)  [also labelled PD8]
FMC_D14: U5.L14(PD9)  [also labelled PD9]
FMC_D15: U5.K15(PD10)  [also labelled PD10]
FMC_NBL0: U5.A6(PE0) ; port FMC_NBL0  [also labelled PE0]
FMC_NBL1: U5.A5(PE1) ; port FMC_NBL1  [also labelled PE1]
FMC_SDCKE0: U5.L4(PC3) ; port FMC_SDCKE0  [also labelled PC3]
FMC_SDCLK: U5.H14(PG8) ; port FMC_SDCLK  [also labelled PG8]
FMC_SDNCAS: U5.B7(PG15) ; port FMC_SDNCAS  [also labelled PG15]
FMC_SDNE0: U5.J4(PH3) ; port FMC_SDNE0  [also labelled PH3]
FMC_SDNRAS: U5.P8(PF11) ; port FMC_SDNRAS  [also labelled PF11]
FMC_SDNWE: U5.J3(PH5) ; port FMC_SDNWE  [also labelled PH5]
LCD_B0: U5.A1(PE4)  [also labelled PE4]
LCD_B1: U5.B9(PJ13)  [also labelled PJ13]
LCD_B2: U5.C9(PJ14)  [also labelled PJ14]
LCD_B3: U5.D10(PJ15)  [also labelled PJ15]
LCD_B4: U5.C7(PG12)  [also labelled PG12]
LCD_B5: U5.D7(PK4)  [also labelled PK4]
LCD_B6: U5.C6(PK5)  [also labelled PK5]
LCD_B7: U5.C5(PK6)  [also labelled PK6]
LCD_BL_CTRL: U5.D8(PK3) ; port LCD_BL_CTRL  [also labelled PK3]
LCD_CLK: U5.H3(PI14) ; port LCD_CLK  [also labelled PI14]
LCD_DE: U5.C4(PK7) ; port LCD_DE  [also labelled PK7]
LCD_DISP: U5.E3(PI12) ; port LCD_DISP  [also labelled PI12]
LCD_G0: U5.J12(PJ7)  [also labelled PJ7]
LCD_G1: U5.H12(PJ8)  [also labelled PJ8]
LCD_G2: U5.J13(PJ9)  [also labelled PJ9]
LCD_G3: U5.H13(PJ10)  [also labelled PJ10]
LCD_G4: U5.G12(PJ11)  [also labelled PJ11]
LCD_G5: U5.G13(PK0)  [also labelled PK0]
LCD_G6: U5.F12(PK1)  [also labelled PK1]
LCD_G7: U5.F13(PK2)  [also labelled PK2]
LCD_HSYNC: U5.D5(PI10) ; port LCD_HSYNC  [also labelled PI10]
LCD_INT: U5.G3(PI13) ; port LCD_INT  [also labelled PI13]
LCD_R0: U5.G4(PI15)  [also labelled PI15]
LCD_R1: U5.R6(PJ0)  [also labelled PJ0]
LCD_R2: U5.R7(PJ1)  [also labelled PJ1]
LCD_R3: U5.P7(PJ2)  [also labelled PJ2]
LCD_R4: U5.N8(PJ3)  [also labelled PJ3]
LCD_R5: U5.M9(PJ4)  [also labelled PJ4]
LCD_R6: U5.M14(PJ5)  [also labelled PJ5]
LCD_R7: U5.K12(PJ6)  [also labelled PJ6]
LCD_VSYNC: U5.E4(PI9) ; port LCD_VSYNC  [also labelled PI9]
NC1: R33.1 U5.C2(PI8-ANTI_TAMP2)  [also labelled PI8]
NC2: R29.1 U5.K4(PH2)  [also labelled PH2]
OSC_25M: R30.1 X2.3(OUT) ; port OSC_25M
OTG_FS_ID: U5.D15(PA10) ; port OTG_FS_ID  [also labelled PA10]
OTG_FS_N: U5.C15(PA11) ; port OTG_FS_N  [also labelled PA11]
OTG_FS_OverCurrent: U5.D11(PD4) ; port OTG_FS_OverCurrent  [also labelled PD4]
OTG_FS_P: U5.B15(PA12) ; port OTG_FS_P  [also labelled PA12]
OTG_FS_PowerSwitchOn: U5.C10(PD5) ; port OTG_FS_PowerSwitchOn  [also labelled PD5]
OTG_FS_VBUS: R58.2 R63.1 ; port OTG_FS_VBUS
OTG_HS_OverCurrent: U5.A2(PE3) ; port OTG_HS_OverCurrent  [also labelled PE3]
PA1: U5.N2(PA1) ; port RMII_REF_CLK  [also labelled RMII_REF_CLK]
PA2: U5.P2(PA2) ; port RMII_MDIO  [also labelled RMII_MDIO]
PA3: U5.R2(PA3)  [also labelled ULPI_D0]
PA5: U5.P4(PA5) ; port ULPI_CK  [also labelled ULPI_CK]
PA7: U5.R3(PA7) ; port RMII_CRS_DV  [also labelled RMII_CRS_DV]
PA9: R63.2 R64.2 U5.E15(PA9)
PA13: U5.A15(PA13) ; port SWDIO  [also labelled SWDIO]
PA14: U5.A14(PA14) ; port SWCLK  [also labelled SWCLK]
PB0: U5.R5(PB0)  [also labelled ULPI_D1]
PB1: U5.R4(PB1)  [also labelled ULPI_D2]
PB2: R44.1 ; port QSPI_CLK  [also labelled QSPI_CLK]
PB3: U5.A10(PB3) ; port SWO  [also labelled SWO]
PB5: U5.A8(PB5)  [also labelled ULPI_D7]
PB6: U5.B6(PB6) ; port QSPI_NCS  [also labelled QSPI_NCS]
PB7: U5.B5(PB7) ; port VCP_RX  [also labelled VCP_RX]
PB10: U5.P12(PB10)  [also labelled ULPI_D3]
PB11: U5.R13(PB11)  [also labelled ULPI_D4]
PB12: U5.L13(PB12)  [also labelled ULPI_D5]
PB13: U5.K14(PB13)  [also labelled ULPI_D6]
PC0: U5.M2(PC0) ; port ULPI_STP  [also labelled ULPI_STP]
PC1: U5.M3(PC1) ; port RMII_MDC  [also labelled RMII_MDC]
PC2: U5.M4(PC2) ; port ULPI_DIR  [also labelled ULPI_DIR]
PC4: U5.N5(PC4) ; port RMII_RXD0  [also labelled RMII_RXD0]
PC5: U5.P5(PC5) ; port RMII_RXD1  [also labelled RMII_RXD1]
PC8: U5.G14(PC8) ; port uSD_D0  [also labelled uSD_D0]
PC9: U5.F14(PC9) ; port uSD_D1  [also labelled uSD_D1]
PC10: U5.B14(PC10) ; port uSD_D2  [also labelled uSD_D2]
PC11: U5.B13(PC11) ; port uSD_D3  [also labelled uSD_D3]
PC12: U5.A12(PC12) ; port uSD_CLK  [also labelled uSD_CLK]
PC13: U5.D1(PC13-ANTI_TAMP) ; port uSD_Detect  [also labelled uSD_Detect]
PC14: R32.2 U5.E1(PC14-OSC32_IN)
PC15: R31.2 U5.F1(PC15-OSC32_OUT)
PD2: U5.D12(PD2) ; port uSD_CMD  [also labelled uSD_CMD]
PD7: U5.A11(PD7) ; port SPDIF_RX0  [also labelled SPDIF_RX0]
PD11: U5.N10(PD11) ; port QSPI_D0  [also labelled QSPI_D0]
PD12: U5.M10(PD12) ; port QSPI_D1  [also labelled QSPI_D1]
PD13: U5.M11(PD13) ; port QSPI_D3  [also labelled QSPI_D3]
PE2: U5.A3(PE2) ; port QSPI_D2  [also labelled QSPI_D2]
PG2: U5.M13(PG2) ; port RMII_RXER  [also labelled RMII_RXER]
PG10: U5.C8(PG10) ; port SAI2_SDB  [also labelled SAI2_SDB]
PG11: U5.B8(PG11) ; port RMII_TX_EN  [also labelled RMII_TX_EN]
PG13: U5.B3(PG13) ; port RMII_TXD0  [also labelled RMII_TXD0]
PG14: U5.A4(PG14) ; port RMII_TXD1  [also labelled RMII_TXD1]
PH0: R30.2 U5.G1(PH0-OSC_IN)
PH1: U5.H1(PH1-OSC_OUT)
PH4: U5.H4(PH4) ; port ULPI_NXT  [also labelled ULPI_NXT]
PH15: U5.D13(PH15) ; port TP_PH15  [also labelled TP_PH15]
PI4: U5.C3(PI4) ; port SAI2_MCLKA  [also labelled SAI2_MCLKA]
PI5: U5.D3(PI5) ; port SAI2_SCKA  [also labelled SAI2_SCKA]
PI6: U5.D6(PI6) ; port SAI2_SDA  [also labelled SAI2_SDA]
PI7: U5.D4(PI7) ; port SAI2_FSA  [also labelled SAI2_FSA]
PJ12: R58.1 U5.B10(PJ12)
VCP_TX: R64.1 ; port VCP_TX
NetC12_2: C12.2 R31.1 X3.2
NetC13_2: C13.2 R32.1 X3.1
NetC47_2: C47.2 U5.L11(VCAP1)
NetC48_2: C48.2 U5.E11(VCAP2)
NetR5_2: R5.2 X2.1(EN)
NetR20_2: R20.2 U5.L5(BYPASS-REG)
NetR29_2: R29.2 TP1.1
NetR33_2: R33.2 TP2.1
NetR35_2: R35.2 R38.2 U5.E5(PDR_ON)
NetR44_2: R44.2 U5.M5(PB2)

### Buses and harness runs
bus ARD_A[0..5] = port ARD_A[0..5]
bus ARD_D[0..15] = port ARD_D[0..15]
bus DCMI_D[0..7] = port DCMI_D[0..7]
bus FMC_A[0..11] = port FMC_A[0..11]
bus FMC_D[0..15] = port FMC_D[0..15]
bus LCD_B[0..7] = port LCD_B[0..7]
bus LCD_G[0..7] = port LCD_G[0..7]
bus LCD_R[0..7] = port LCD_R[0..7]
bus PA[0..15] = port PA[0..15]
bus PB[0..15] = port PB[0..15]
bus PC[0..15] = port PC[0..15]
bus PD[0..15] = port PD[0..15]
bus PE[0..15] = port PE[0..15]
bus PF[0..15] = port PF[0..15]
bus PG[0..15] = port PG[0..15]
bus PH[0..15] = port PH[0..15]
bus PI[0..15] = port PI[0..15]
bus PJ[0..15] = port PJ[0..15]
bus PK[0..7] = port PK[0..7]
bus ULPI_D[0..7] = port ULPI_D[0..7]

### Notes on the sheet
- Ceramic capacitor (Low ESR)
- Title:
- Project:
- Size:
- Revision:
- Variant:
- A3
- -
- Date:
- Reference:
- Sheet:
- of

### Library data of the parts
C5 C11 C18-C24 C32 C33 C35-C37 C39 C40 C44 C55-C59 = Cap_100nF_X7R_10%_0402: as C110 on sheet USB_OTG_HS; Revision: July-2002: Re-released for DXP Platform.; Value: 100nF; Order: CC0402KRX7R7BB104; Manuf_1: YAGEO
C8 C17 = Cap_1uF_POL_10%_TANA: Polarized Capacitor,1uF,16V,10%,typeA,AVX; Manuf_Part_1: TAJA105K016R; Revision: July-2002: Re-released for DXP Platform.; Value: 1uF; Manuf_1: AVX; Distrib: *; Order: TAJA105K016R; ECCN_US/EU: n/a
C12 C13 = Cap_4.7pF_NPO_-+0.25pF_0402: Capacitor, 4.7pF, 50V, NPO, -+0.25pF, 0402, YAGEO; Manuf_Part_1: CC0402CRNPO9BN4R7; Order: 311-1367-2-ND; Revision: July-2002: Re-released for DXP Platform.; Value: 4.7pF; Manuf_1: YAGEO; ECCN_US/EU: n/a; Distrib: DIGIKEY
C14 C54 = Cap_4.7uF_POL_10%_TANA: Polarized Capacitor,4.7uF,16V,10%,typeA,AVX; Manuf_Part_1: TAJA475K016R; Revision: July-2002: Re-released for DXP Platform.; Value: 4.7uF; Manuf_1: AVX; Order: TAJA475K016R; ECCN_US/EU: n/a
C47 C48 = Cap_2.2uF_X7R_10%_1206: Capacitor,2.2uF,16V, X7R,10%,1206,YAGEO; Manuf_Part_1: CC1206KKX7R7BB225; Manuf_Part_2: C1206C225K4RAC; Manuf_2: KEMET; Revision: July-2002: Re-released for DXP Platform.; Value: 2.2uF; Order: CC1206KKX7R7BB225; Manuf_1: YAGEO; ECCN_US/EU: n/a
L1 = BEAD_600R_350MA_0603: Bead,600R,350mA,0603,FCM1608KF-601T03,Tai-tech; Manuf_2: TDK; Manuf_Part_2: MPZ1608S300A; Manuf_Part_3: BLM18PG121SN1D; Manuf_3: MURATA; Value: 100uH; Description_2: Bead,30R,5A,0603,MPZ1608S300A,TDK; Description_3: Bead,120R,2A,0603,BLM18PG121SN1D,MURATA; Revision: July-2002: Re-released for DXP Platform.; Manuf_Part_1: FCM1608KF-601T03; Manuf_1: Tai-tech; ECCN_US/EU: n/a
R5 R20 R34 R38 R45 = Res_10K_1%_0402: Resistor,10K,0402,1%,YAGEO; Manuf_Part_1: RC0402FR-0710KL; Value: 10K; Manuf_1: YAGEO; Order: RC0402FR-0710KL; ECCN_US/EU: n/a
R21 R28 = Res_0_5%_0603: Resistor,0,0603,5%,YAGEO; Manuf_Part_1: RC0603JR-070RL; Order: 2363481; Value: 0; ECCN_US/EU: n/a; Manuf_1: YAGEO; Distrib: FARNELL
R29 R33 R58 = Res_100_1%_0402: Resistor,100,0402,1%,YAGEO; Manuf_Part_1: RC0402FR-07100RL; Order: 9239111; Value: 100; Manuf_1: YAGEO; ECCN_US/EU: n/a; Distrib: FARNELL
R30 = Res_100_1%_0402: as R114 on sheet USB_OTG_HS; Manuf_1: YAGEO; ECCN_US/EU: n/a; Distrib: FARNELL
R31 R32 R44 R64 = Res_0_5%_0402: as R130 on sheet USB_OTG_HS; Value: 0; ECCN_US/EU: n/a; Manuf_1: YAGEO; Distrib: FARNELL
R35 R42 R63 = Res_NA_0402: Resistor,[NA],0402; Fitted: NO; Value: [NA]; ECCN_US/EU: n/a
R46 R54 R61 R62 = Res_2K7_1%_0402: Resistor,2K7,0402,1%,YAGEO; Manuf_Part_1: RC0402FR-072K7L; Value: 2K7; Manuf_1: YAGEO; Order: RC0402FR-072K7L; ECCN_US/EU: n/a; Distrib: FARNELL
TP1 TP2 = TP: Test Point; ECCN_US/EU: n/a
U5 = STM32F746NGH6U: STM32F746NGH6 (STM32F7 Birdie) TBGA216; Manuf_1: STM; ECCN_US/EU: 3A991A2/NEC; Ref St: 9175176; Provided: ST; Distrib: ST; Manuf_Part_1: STM32F746NGH6U; Order: STM32F746NGH6U
X2 = OSC_25M_NZ2520SB: Oscillator 25.00Mhz, -+50PPM, 3.3V, Temp -55 to +125°C; Manuf_Part_1: NZ2520SH 25MHz END4869C; Manuf_1: NDK; ECCN_US/EU: EAR99/NEC; Provided: ST; Order: *
X3 = XTAL_32K_NX3215SA: Crystal 32.768kHz, 6pF, -+20PPM, R=50K, SMD; Manuf_1: NDK; Manuf_Part_1: NX3215SA 32.768KHz EXS00A-MU00525; ECCN_US/EU: EAR99/NEC; Ref St: 9157034; NDK Ref: X3101802; Provided: ST; Distrib: *; Order: NX3215SA 32.768KHz EXS00A-MU00525

## Sheet Ethernet.SchDoc: Ethernet PHY with RJ45 connector
size A4; Date: 25-FEB-2015; Author: A.B; CompanyName: STMicroelectronics; Address1: 12, Rue Jules HOROWITZ; Address2: 38019 Grenoble; Address3: FRANCE; DocumentNumber: MB1191; Revision: B-02; SheetNumber: 12; SheetTotal: 14; Project: STM32F746G-DISCO
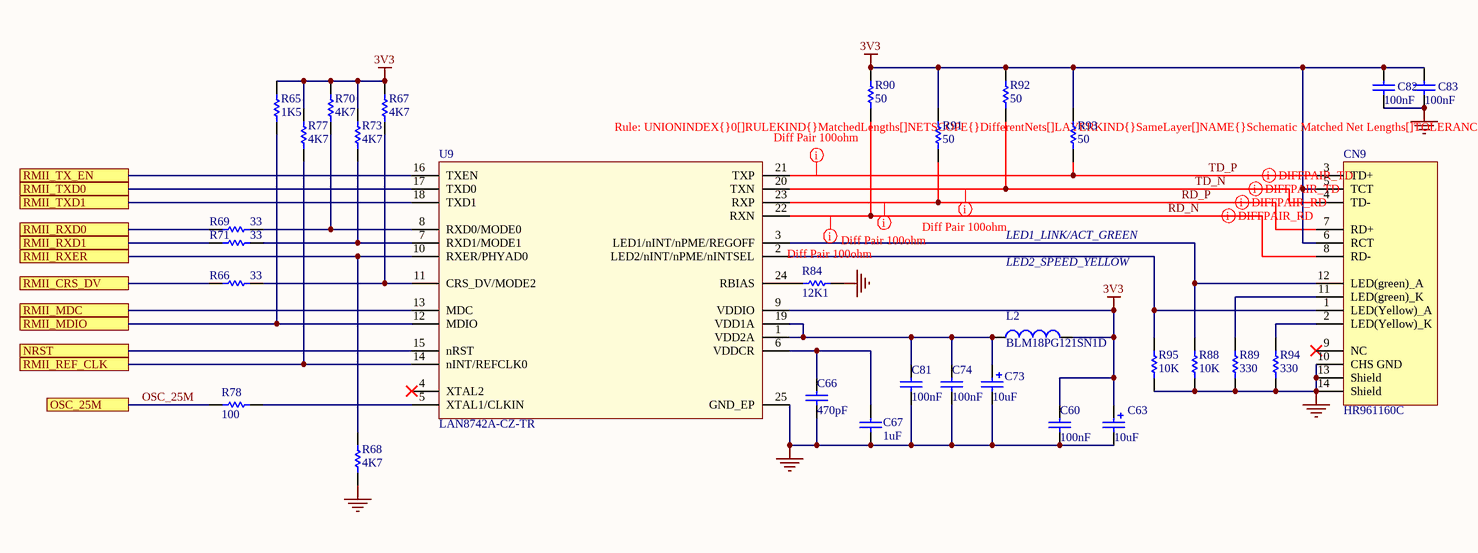
[diagram p12: Ethernet.SchDoc]

### Parts
C60  100nF  [0402C]
C63  10uF  [TAN-A]
C66  470pF  [0402C]
C67  1uF  [0603C]
C73  10uF  [TAN-A]
C74  100nF  [0402C]
C81  100nF  [0402C]
C82  100nF  [0402C]
C83  100nF  [0402C]
CN9  HR961160C  [RJ45_HR961160C]
L2  BLM18PG121SN1D  [0603L]
R65  1K5  [0402R]
R66  33  [0402R]
R67  4K7  [0402R]
R68  4K7  [0402R]
R69  33  [0402R]
R70  4K7  [0402R]
R71  33  [0402R]
R73  4K7  [0402R]
R77  4K7  [0402R]
R78  100  [0402R]
R84  12K1  [0603R]
R88  10K  [0402R]
R89  330  [0402R]
R90  50  [0402R]
R91  50  [0402R]
R92  50  [0402R]
R93  50  [0402R]
R94  330  [0402R]
R95  10K  [0402R]
U9  LAN8742A-CZ-TR  [QFN24_0R5_4X4]

### Ports
NRST, OSC_25M, RMII_CRS_DV, RMII_MDC, RMII_MDIO, RMII_REF_CLK, RMII_RXD0, RMII_RXD1, RMII_RXER, RMII_TX_EN, RMII_TXD0, RMII_TXD1

### Nets
3V3: C60.2 C63.1 C82.2 C83.2 CN9.5(TCT) CN9.6(RCT) L2.2 R65.2 R67.2 R70.2 R73.2 R77.2 R90.1 R91.1 R92.1 R93.1 U9.9(VDDIO)
GND: C60.1 C63.2 C66.1 C67.1 C73.2 C74.1 C81.1 C82.1 C83.1 CN9.10(CHS_GND) CN9.13(Shield) CN9.14(Shield) R68.1 R84.2 R88.1 R89.1 R94.1 R95.1 U9.25(GND_EP)
DCMI_NRST: U9.15(nRST) ; port NRST
OSC_25M: R78.1 ; port OSC_25M
PA1: R77.1 U9.14(nINT/REFCLK0) ; port RMII_REF_CLK
PA2: R65.1 U9.12(MDIO) ; port RMII_MDIO
PA7: R66.2 ; port RMII_CRS_DV
PC1: U9.13(MDC) ; port RMII_MDC
PC4: R69.2 ; port RMII_RXD0
PC5: R71.2 ; port RMII_RXD1
PG2: R68.2 U9.10(RXER/PHYAD0) ; port RMII_RXER
PG11: U9.16(TXEN) ; port RMII_TX_EN
PG13: U9.17(TXD0) ; port RMII_TXD0
PG14: U9.18(TXD1) ; port RMII_TXD1
RD_N: CN9.8(RD-) R90.2 U9.22(RXN)
RD_P: CN9.7(RD+) R91.2 U9.23(RXP)
TD_N: CN9.4(TD-) R92.2 U9.20(TXN)
TD_P: CN9.3(TD+) R93.2 U9.21(TXP)
NetC66_2: C66.2 C67.2 U9.6(VDDCR)
NetC73_1: C73.1 C74.2 C81.2 L2.1 U9.1(VDD2A) U9.19(VDD1A)
NetCN9_1: CN9.1(LED(Yellow)_A) R95.2 U9.2(LED2/nINT/nPME/nINTSEL)
NetCN9_2: CN9.2(LED(Yellow)_K) R94.2
NetCN9_11: CN9.11(LED(green)_K) R89.2
NetCN9_12: CN9.12(LED(green)_A) R88.2 U9.3(LED1/nINT/nPME/REGOFF)
NetR66_1: R66.1 R67.1 U9.11(CRS_DV/MODE2)
NetR69_1: R69.1 R70.1 U9.8(RXD0/MODE0)
NetR71_1: R71.1 R73.1 U9.7(RXD1/MODE1)
NetR78_2: R78.2 U9.5(XTAL1/CLKIN)
NetR84_1: R84.1 U9.24(RBIAS)

Not connected (* = marked no-connect by the designer): CN9 9(NC)*; U9 4(XTAL2)*

### Layout directives
differential pair: RD_N, RD_P, TD_N, TD_P
rule Matched Net Lengths [Tolerance = 100mil]: RD_N, RD_P, TD_N, TD_P

### Notes on the sheet
- LED2_SPEED_YELLOW
- LED1_LINK/ACT_GREEN
- Title:
- Project:
- Size:
- Revision:
- Variant:
- A4
- -
- Date:
- Reference:
- Sheet:
- of

### Library data of the parts
C60 C74 C81-C83 = Cap_100nF_X7R_10%_0402: as C110 on sheet USB_OTG_HS; Revision: July-2002: Re-released for DXP Platform.; Value: 100nF; Order: CC0402KRX7R7BB104; Manuf_1: YAGEO
C63 C73 = Cap_10uF_POL_10%_TANA: Polarized Capacitor,10uF,10V,10%,typeA,VISHAY; Manuf_Part_1: 293D106X9010A2TE3; Revision: July-2002: Re-released for DXP Platform.; Value: 10uF; Manuf_1: VISHAY; Order: *; ECCN_US/EU: n/a
C66 = Cap_470pF_X7R_10%_0402: Capacitor,470pF,16V,X7R,10%,0402,YAGEO; Manuf_Part_1: 0402YC471KAT4A; Manuf_1: AVX; Revision: July-2002: Re-released for DXP Platform.; Value: 470pF; Order: 0402YC471KAT4A; ECCN_US/EU: n/a
C67 = Cap_1uF_X5R_10%_0603: Capacitor,1uF,16V,X5R,10%,0603,YAGEO; Manuf_Part_1: CC0603KRX5R7BB105; Revision: July-2002: Re-released for DXP Platform.; Value: 1uF; Order: CC0603KRX5R7BB105; Manuf_1: YAGEO; ECCN_US/EU: n/a
CN9 = HR961160C: 100 Base-TX (Fast Ethernet) SMD RJ45 single port (1x1) with LEDS Integrated Magnetics Connector; Manuf_1: HanRun; Manuf_2: Pulse Electronics Corporation; Manuf_Part_2: J3011G21DNLT; Manuf_3: K.O.D International Holding; Manuf_Part_3: RMT-119A-12F6-GY-04; Distrib: Sub Co; Manuf_Part_1: HR961160C; Order: *
L2 = BEAD_120R_2A_0603: as L6 on sheet USB_OTG_HS; Revision: July-2002: Re-released for DXP Platform.; ECCN_US/EU: n/a; Manuf_Part_1: BLM18PG121SN1D; Manuf_1: MURATA
R65 = Res_1K5_1%_0402: Resistor,1K5,0402,1%,YAGEO; Manuf_Part_1: RC0402FR-071K5L; Value: 1K5; Manuf_1: YAGEO; Order: RC0402FR-071K5L; ECCN_US/EU: n/a; Distrib: FARNELL
R66 R69 R71 = Res_33_1%_0402: Resistor,33,0402,1%,YAGEO; Manuf_Part_1: RC0402FR-0733RL; Value: 33; Manuf_1: YAGEO; Order: *; ECCN_US/EU: n/a; Distrib: FARNELL
R67 R68 R70 R73 R77 = Res_4K7_1%_0402: Resistor,4K7,0402,1%,YAGEO; Manuf_Part_1: RT0402FRE074K7L; Value: 4K7; Manuf_1: YAGEO; Order: RT0402FRE074K7L; ECCN_US/EU: n/a
R78 = Res_100_1%_0402: as R29 on sheet STM32F7; Value: 100; Manuf_1: YAGEO; ECCN_US/EU: n/a; Distrib: FARNELL
R84 = Res_12K1_1%_0603: Resistor,12K1,0603,1%,VISHAY; Manuf_Part_1: MCT 0603-50 1% P5 12K1; Order: 2325243; Value: 12K1; ECCN_US/EU: n/a; Manuf_1: VISHAY; Distrib: FARNELL
R88 R95 = Res_10K_1%_0402: as R5 on sheet STM32F7; Value: 10K; Manuf_1: YAGEO; Order: RC0402FR-0710KL; ECCN_US/EU: n/a
R89 R94 = Res_330_1%_0402: Resistor,330,0402,1%,YAGEO; Manuf_Part_1: RC0402FR-07330RL; Value: 330; ECCN_US/EU: n/a; Manuf_1: YAGEO; Distrib: DIGIKEY; Order: RC0402FR-07330RL
R90-R93 = Res_50_1%_0402: Resistor,50,0402,1%,YAGEO; Manuf_Part_1: RC0402FR-0749R9L; Value: 49.9; Manuf_1: YAGEO; Order: *; ECCN_US/EU: n/a; Distrib: FARNELL
U9 = LAN8742A-CZ-TR: LAN8742A-CZ-TR - Small Footprint RMII 10/100 Ethernet, Transceiver with HP Auto-MDIX and flexPWR Technology SQFN-24; Manuf_1: MICROCHIP; Order: LAN8742A-CZ-TR; Manuf_Part_1: LAN8742A-CZ-TR; Distrib: MICROCHIP

## Sheet Camera-Connectors.SchDoc: External Camera connector
size A4; Date: 25-FEB-2015; Author: A.B; CompanyName: STMicroelectronics; Address1: 12, Rue Jules HOROWITZ; Address2: 38019 Grenoble; Address3: FRANCE; DocumentNumber: MB1191; Revision: B-02; SheetNumber: 13; SheetTotal: 14; Project: STM32F746G-DISCO
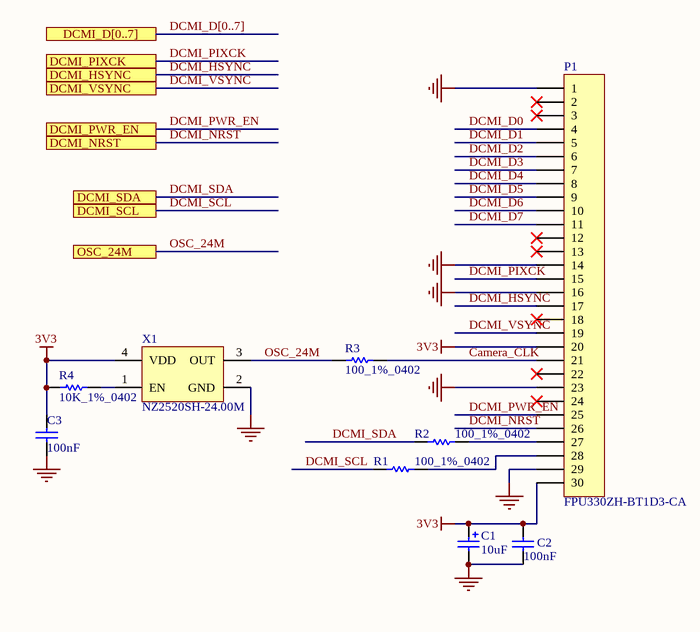
[diagram p13: Camera-Connectors.SchDoc]

### Parts
C1  10uF  [TAN-A]
C2  100nF  [0402C]
C3  100nF  [0402C]
P1  FPU330ZH-BT1D3-CA  [FPU330ZH-BT1D3-CA]
R1  100_1%_0402  [0402R]
R2  100_1%_0402  [0402R]
R3  100_1%_0402  [0402R]
R4  10K_1%_0402  [0402R]
X1  NZ2520SH-24.00M  [NZ2520SH_4P]

### Ports
DCMI_D[0..7], DCMI_HSYNC, DCMI_NRST, DCMI_PIXCK, DCMI_PWR_EN, DCMI_SCL, DCMI_SDA, DCMI_VSYNC, OSC_24M

### Nets
3V3: C1.1 C2.2 C3.2 P1.20 P1.30 R4.1 X1.4(VDD)
GND: C1.2 C2.1 C3.1 P1.1 P1.14 P1.16 P1.23 P1.29 X1.2(GND)
Camera_CLK: P1.21 R3.2
DCMI_D0: P1.4
DCMI_D1: P1.5
DCMI_D2: P1.6
DCMI_D3: P1.7
DCMI_D4: P1.8
DCMI_D5: P1.9
DCMI_D6: P1.10
DCMI_D7: P1.11
DCMI_HSYNC: P1.17 ; port DCMI_HSYNC
DCMI_NRST: P1.26 ; port DCMI_NRST
DCMI_PIXCK: P1.15 ; port DCMI_PIXCK
DCMI_PWR_EN: P1.25 ; port DCMI_PWR_EN
DCMI_SCL: R1.1 ; port DCMI_SCL  [project net ARD_D15]
DCMI_SDA: R2.1 ; port DCMI_SDA  [project net ARD_D14]
DCMI_VSYNC: P1.19 ; port DCMI_VSYNC
OSC_24M: R3.1 X1.3(OUT) ; port OSC_24M
NetP1_27: P1.27 R2.2
NetP1_28: P1.28 R1.2
NetR4_2: R4.2 X1.1(EN)

Not connected (* = marked no-connect by the designer): P1 2* 3* 12* 13* 18* 22* 24*

### Buses and harness runs
bus DCMI_D[0..7] = port DCMI_D[0..7]

### Notes on the sheet
- Title:
- Project:
- Size:
- Revision:
- Variant:
- A4
- -
- Date:
- Reference:
- Sheet:
- of

### Library data of the parts
C1 = Cap_10uF_POL_10%_TANA: as C63 on sheet Ethernet; Revision: July-2002: Re-released for DXP Platform.; Value: 10uF; Manuf_1: VISHAY; Order: *; ECCN_US/EU: n/a
C2 C3 = Cap_100nF_X7R_10%_0402: as C110 on sheet USB_OTG_HS; Revision: July-2002: Re-released for DXP Platform.; Value: 100nF; Order: CC0402KRX7R7BB104; Manuf_1: YAGEO
P1 = FPU330ZH-BT1D3-CA: TOWNES -  Connector FFC/FPC ZIF 0.5mm 30 pins, Lower Contacts; Manuf_Part_2: TFP-A330ZH-BT1-ECX; Manuf_Part_1: FPU330ZH-BT1D3-CA; Order: *; Manuf_1: TOWNES; Distrib: Sub Co; ECCN_US/EU: n/a; Manuf_2: TOWNES
R1-R3 = Res_100_1%_0402: as R114 on sheet USB_OTG_HS; Manuf_1: YAGEO; ECCN_US/EU: n/a; Distrib: FARNELL
R4 = Res_10K_1%_0402: as R5 on sheet STM32F7; Value: 10K; Manuf_1: YAGEO; Order: RC0402FR-0710KL; ECCN_US/EU: n/a
X1 = OSC_24M_NZ2520SB: Oscillator 24.00Mhz, -+50PPM, 3.3V, Temp -55 to +125°C; Manuf_Part_1: NZ2520SH 24MHz END4869D; Manuf_1: NDK; ECCN_US/EU: EAR99/NEC; Provided: ST; Order: *